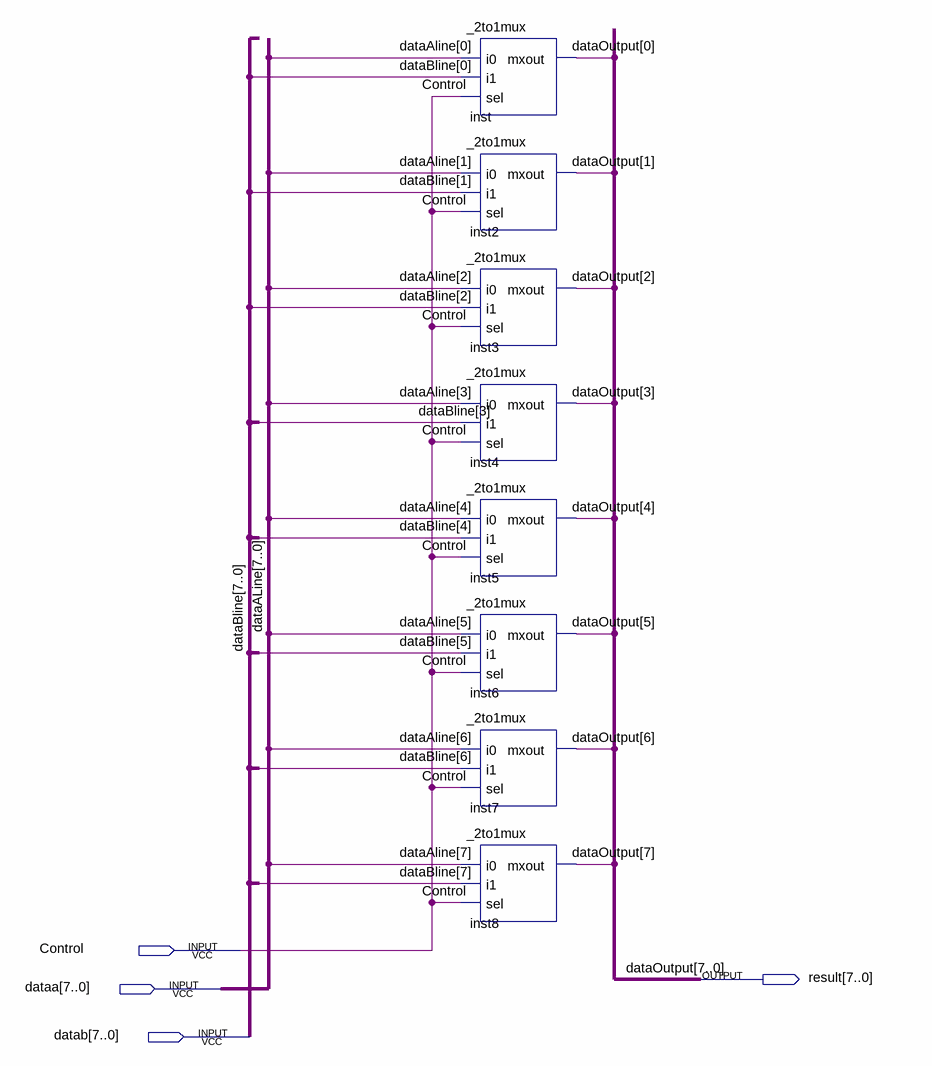
[diagram p0: schematic sheet]
// Quartus schematic 8WidWideBusMux.bdf as structural Verilog: 8 symbols, 4 pins
module \8WidWideBusMux  (
  input  Control,
  input  [7:0] dataa,
  input  [7:0] datab,
  output [7:0] result
);

  _2to1mux inst (.i0(dataa[0]), .i1(datab[0]), .sel(Control), .mxout(result[0]));
  _2to1mux inst2 (.i0(dataa[1]), .i1(datab[1]), .sel(Control), .mxout(result[1]));
  _2to1mux inst3 (.i0(dataa[2]), .i1(datab[2]), .sel(Control), .mxout(result[2]));
  _2to1mux inst4 (.i0(dataa[3]), .i1(datab[3]), .sel(Control), .mxout(result[3]));
  _2to1mux inst5 (.i0(dataa[4]), .i1(datab[4]), .sel(Control), .mxout(result[4]));
  _2to1mux inst6 (.i0(dataa[5]), .i1(datab[5]), .sel(Control), .mxout(result[5]));
  _2to1mux inst7 (.i0(dataa[6]), .i1(datab[6]), .sel(Control), .mxout(result[6]));
  _2to1mux inst8 (.i0(dataa[7]), .i1(datab[7]), .sel(Control), .mxout(result[7]));

  // Other names for the same wires on the sheet: dataAline[7:0] = dataa; dataBline[7:0] = datab;
  //   dataOutput[7:0] = result
endmodule
